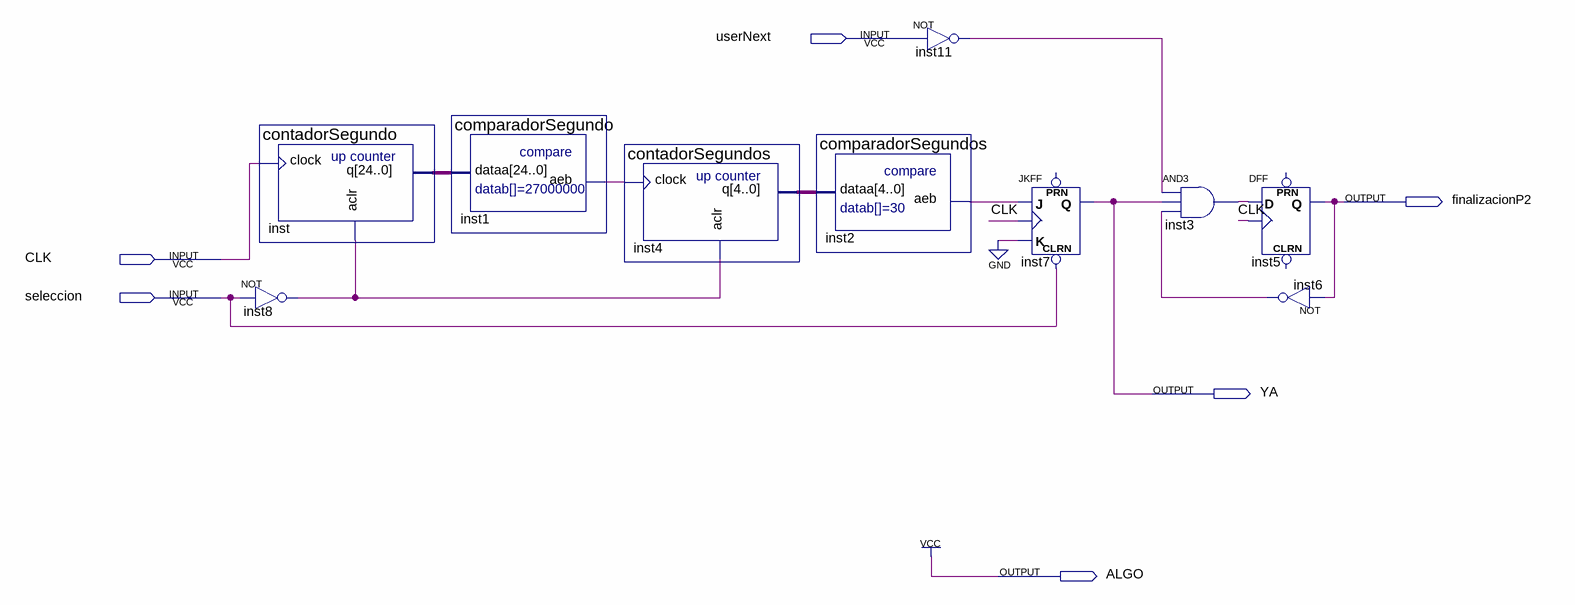
[diagram p0: schematic sheet]
// Quartus schematic procesoCuatro.bdf as structural Verilog: 10 symbols, 6 pins
module procesoCuatro (
  input  userNext,
  input  CLK,
  input  seleccion,
  output finalizacionP2,
  output YA,
  output ALGO
);

  wire inst1_aeb, inst2_aeb, inst3_out, inst6_out, inst8_out, inst11_out;
  wire [4:0] inst4_q;
  wire [24:0] inst_q;

  not inst8 (inst8_out, seleccion);
  contadorSegundo inst (.clock(CLK), .aclr(inst8_out), .q(inst_q));
  comparadorSegundo inst1 (.dataa(inst_q), .aeb(inst1_aeb));
  contadorSegundos inst4 (.clock(inst1_aeb), .aclr(inst8_out), .q(inst4_q));
  comparadorSegundos inst2 (.dataa(inst4_q), .aeb(inst2_aeb));
  not inst11 (inst11_out, userNext);
  JKFF inst7 (.CLRN(seleccion), .K(1'b0), .J(inst2_aeb), .CLK(CLK), .Q(YA));  // open: PRN
  and inst3 (inst3_out, inst11_out, YA, inst6_out);
  DFF inst5 (.CLK(CLK), .D(inst3_out), .Q(finalizacionP2));  // open: CLRN, PRN
  not inst6 (inst6_out, finalizacionP2);

  assign ALGO = 1'b1;
endmodule
